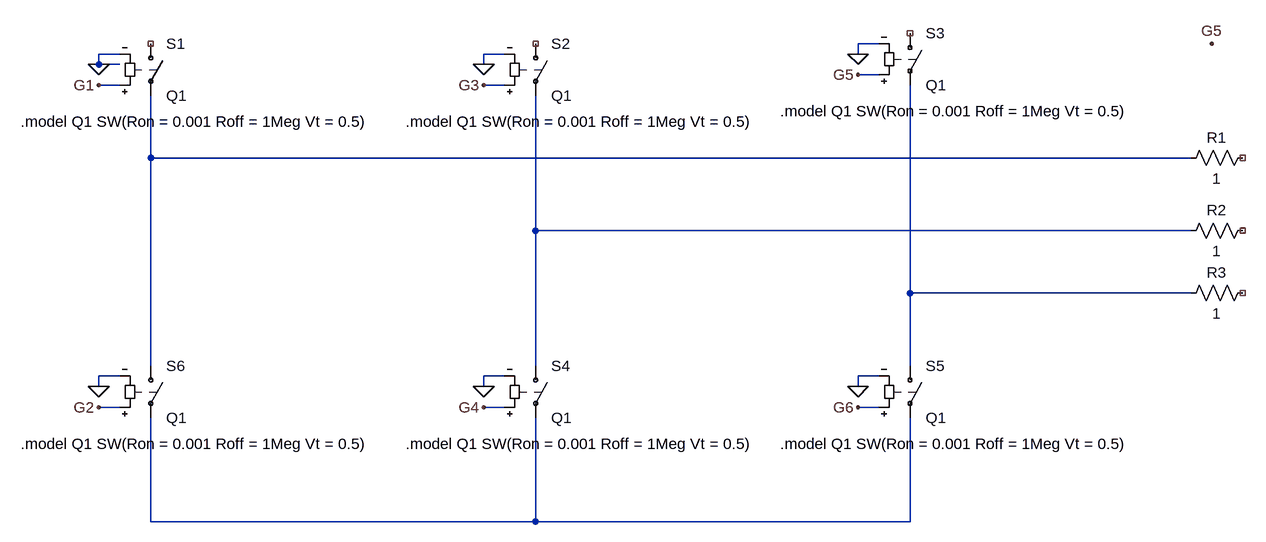
[diagram p0: schematic SW.asc]
SW.asc, the LTspice schematic file:
Version 4
SHEET 1 1128 680
WIRE 560 -320 528 -320
WIRE -608 -304 -640 -304
WIRE -16 -304 -48 -304
WIRE 528 -304 528 -320
WIRE -640 -288 -640 -304
WIRE -640 -288 -656 -288
WIRE -608 -288 -640 -288
WIRE -48 -288 -48 -304
WIRE 560 -272 528 -272
WIRE -608 -256 -640 -256
WIRE -16 -256 -48 -256
WIRE -560 -144 -560 -240
WIRE 1040 -144 -560 -144
WIRE 32 -32 32 -240
WIRE 1040 -32 32 -32
WIRE 608 64 608 -256
WIRE 1040 64 608 64
WIRE -560 176 -560 -144
WIRE 32 176 32 -32
WIRE 608 176 608 64
WIRE -608 192 -640 192
WIRE -16 192 -48 192
WIRE 560 192 528 192
WIRE -640 208 -640 192
WIRE -640 208 -656 208
WIRE -48 208 -48 192
WIRE 528 208 528 192
WIRE -608 240 -640 240
WIRE -16 240 -48 240
WIRE 560 240 528 240
WIRE -560 416 -560 256
WIRE 32 416 32 256
WIRE 32 416 -560 416
WIRE 608 416 608 256
WIRE 608 416 32 416
FLAG -640 -256 G1
FLAG -640 -288 0
FLAG -48 -256 G3
FLAG -48 -288 0
FLAG 1072 -320 G5
FLAG 528 -272 G5
FLAG 528 -304 0
FLAG -48 240 G4
FLAG -48 208 0
FLAG 528 240 G6
FLAG 528 208 0
FLAG -640 240 G2
FLAG -640 208 0
SYMBOL res 1136 -160 R90
WINDOW 0 0 56 VBottom 2
WINDOW 3 32 56 VTop 2
SYMATTR InstName R1
SYMATTR Value 1
SYMBOL res 1136 -48 R90
WINDOW 0 0 56 VBottom 2
WINDOW 3 32 56 VTop 2
SYMATTR InstName R2
SYMATTR Value 1
SYMBOL res 1136 48 R90
WINDOW 0 0 56 VBottom 2
WINDOW 3 32 56 VTop 2
SYMATTR InstName R3
SYMATTR Value 1
SYMBOL sw -560 -336 R0
SYMATTR InstName S1
SYMATTR Value Q1
SYMBOL sw 32 -336 R0
SYMATTR InstName S2
SYMATTR Value Q1
SYMBOL sw 608 -352 R0
SYMATTR InstName S3
SYMATTR Value Q1
SYMBOL sw 32 160 R0
SYMATTR InstName S4
SYMATTR Value Q1
SYMBOL sw 608 160 R0
SYMATTR InstName S5
SYMATTR Value Q1
SYMBOL sw -560 160 R0
SYMATTR InstName S6
SYMATTR Value Q1
TEXT -760 -200 Left 2 !.model Q1 SW(Ron = 0.001 Roff = 1Meg Vt = 0.5)
TEXT -168 -200 Left 2 !.model Q1 SW(Ron = 0.001 Roff = 1Meg Vt = 0.5)
TEXT 408 -216 Left 2 !.model Q1 SW(Ron = 0.001 Roff = 1Meg Vt = 0.5)
TEXT -168 296 Left 2 !.model Q1 SW(Ron = 0.001 Roff = 1Meg Vt = 0.5)
TEXT 408 296 Left 2 !.model Q1 SW(Ron = 0.001 Roff = 1Meg Vt = 0.5)
TEXT -760 296 Left 2 !.model Q1 SW(Ron = 0.001 Roff = 1Meg Vt = 0.5)

The netlist it stands for:
* SW.asc
R1 NC_01 N001 1
R2 NC_02 N002 1
R3 NC_03 N003 1
* S1: Q1 (symbol sw not certain, pin order unknown); nets seen at it: 0, G1, N001
S2 NC_05 N002 G3 0 Q1
S3 NC_06 N003 G5 0 Q1
S4 N002 N004 G4 0 Q1
S5 N003 N004 G6 0 Q1
S6 N001 N004 G2 0 Q1
.model Q1 SW(Ron = 0.001 Roff = 1Meg Vt = 0.5)
.model Q1 SW(Ron = 0.001 Roff = 1Meg Vt = 0.5)
.model Q1 SW(Ron = 0.001 Roff = 1Meg Vt = 0.5)
.model Q1 SW(Ron = 0.001 Roff = 1Meg Vt = 0.5)
.model Q1 SW(Ron = 0.001 Roff = 1Meg Vt = 0.5)
.model Q1 SW(Ron = 0.001 Roff = 1Meg Vt = 0.5)
.backanno
.end